# Altium schematic sheet Connectors.SchDoc
size A4; SheetNumber: 2; SheetTotal: 2
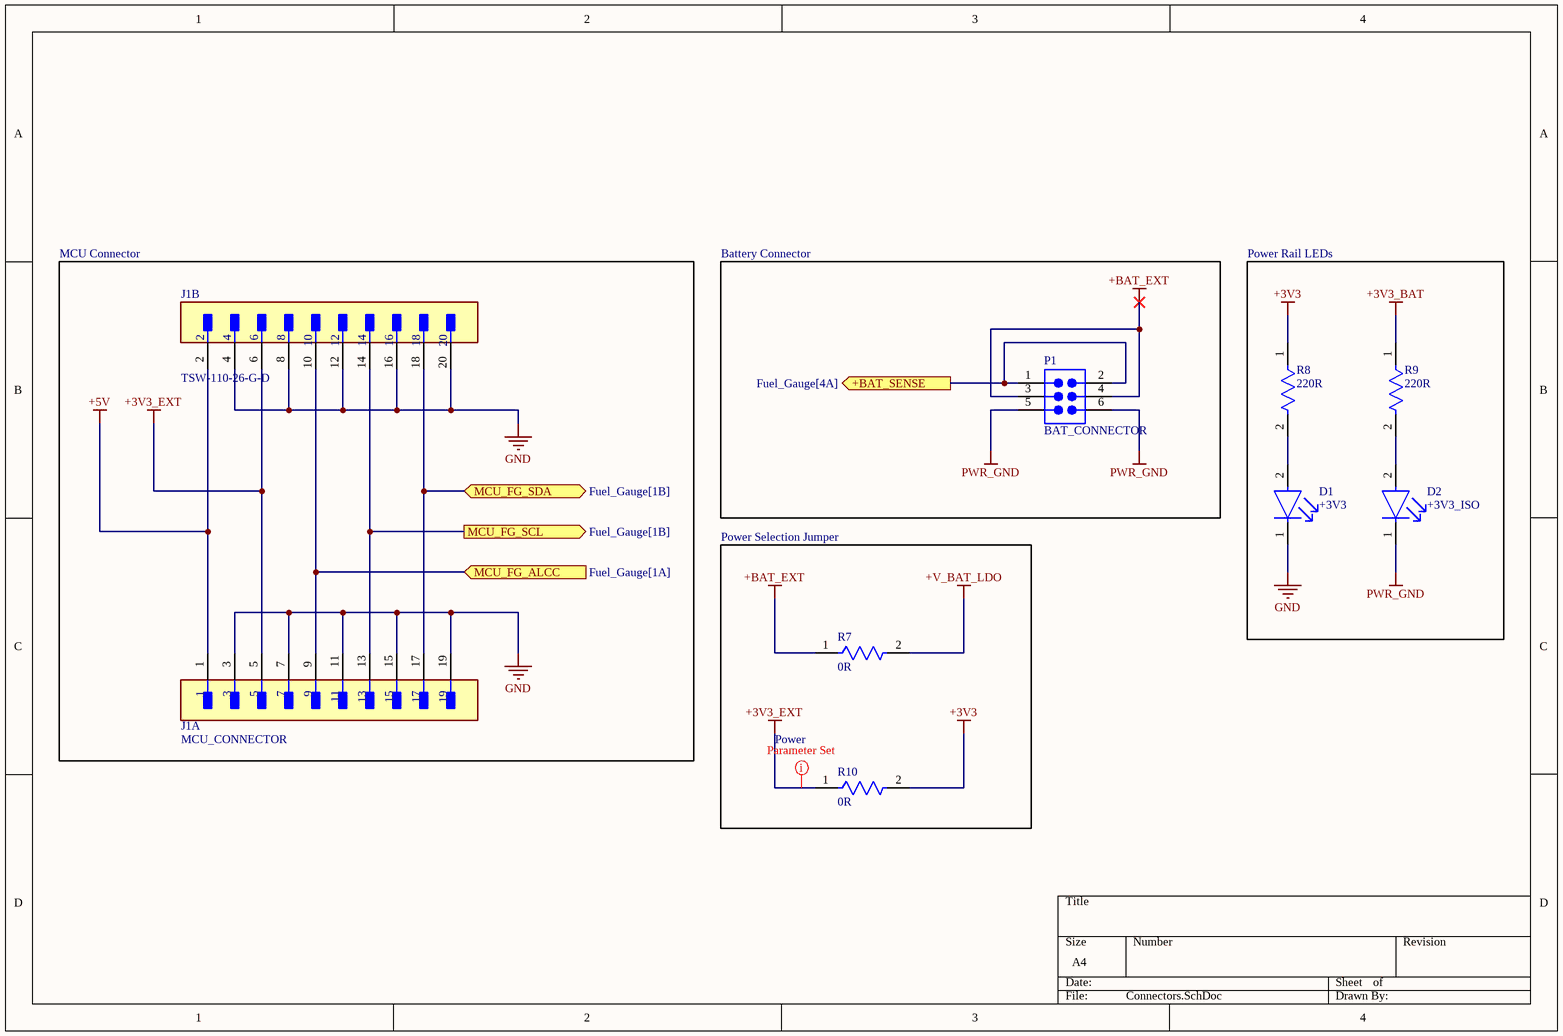
[diagram p0: Connectors.SchDoc]

## Parts
D1  +3V3  [FP-LTST-C170GKT-MFG]
D2  +3V3_ISO  [FP-LTST-C170GKT-MFG]
J1  MCU_CONNECTOR  [FP-TSW-110-26-G-D-MFG]  (parts A,B of 2)
P1  BAT_CONNECTOR  [SMTC-TSW-103-08-X-D]
R7  0R  [FP-AF0805-IPC_B]
R8  220R  [FP-RT0805-MFG]
R9  220R  [FP-RT0805-MFG]
R10  0R  [FP-AF0805-IPC_B]

## Blocks framed on the sheet
MCU Connector: J1
Battery Connector: P1
Power Rail LEDs: D1 D2 R8 R9
Power Selection Jumper: R7 R10

## Ports
+BAT_SENSE (out, see Fuel_Gauge[4A]), MCU_FG_ALCC (in, see Fuel_Gauge[1A]), MCU_FG_SCL (out, see Fuel_Gauge[1B]), MCU_FG_SDA (bidir, see Fuel_Gauge[1B])

## Nets
+3V3: R8.1 R10.2
+3V3_BAT: R9.1
+3V3_EXT: J1.5 J1.6 R10.1
+5V: J1.1 J1.2
+BAT_EXT: P1.3 P1.4 R7.1
+V_BAT_LDO: R7.2
GND: D1.1(C) J1.3 J1.4 J1.7 J1.8 J1.11 J1.12 J1.15 J1.16 J1.19 J1.20
PWR_GND: D2.1(C) P1.5 P1.6
+BAT_SENSE: P1.1 P1.2 ; port +BAT_SENSE
MCU_FG_ALCC: J1.9 J1.10 ; port MCU_FG_ALCC
MCU_FG_SCL: J1.13 J1.14 ; port MCU_FG_SCL
MCU_FG_SDA: J1.17 J1.18 ; port MCU_FG_SDA
NetD1_2: D1.2(A) R8.2
NetD2_2: D2.2(A) R9.2

## Layout directives
net class Power: +3V3_EXT

## Library data of the parts
D1 D2 = CMP-1674-00002-6: LED GREEN CLEAR SMD; Dominant Wavelength: 569nm; Lens Style: Diffused; Forward Voltage: 2.1V; Number of Elements: 1; Wavelength: 565nm; Luminous Intensity: 6mcd; Test Current: 10mA; Power Dissipation: 100mW; Reverse Voltage: 5V; Forward Current: 30mA; Viewing Angle: 130°; Lens Color: Colorless; Min Operating Temperature: -55°C; Number of Pins: 2; Max Operating Temperature: 85°C; Color: Green; Radiation Hardening: No; Illumination Color: Green; Case Code (Metric): 2012; Lens Transparency: Clear; Case/Package: 0805; Width: 1.25mm; Case Code (Imperial): 0805; Package Quantity: 1; Height: 1.1mm; Depth: 1.25mm; Length: 2mm; Power Rating: 100mW; Lead Free: Lead Free; Number of LEDs: 1; Packaging: Tape and Reel; Mount: Surface Mount; Voltage: 5V
J1 = CMP-02766-000032-1: CONN HEADER VERT 20POS 2.54MM; Manufacturer Part Number: TSW-110-26-G-D; Manufacturer: Samtec; Conn Orientation: Vertical; Number Of Contacts: 20; Conn Gender: Male; Footprint Url: http://suddendocs.samtec.com/prints/tsw-xxx-xx-x-x-xx-xxx-footprint.pdf; Automotive: No; RoHS: TRUE; Device Class L1: Connectors; Temperature Range Low: -55°C; ComponentLink2Description: Datasheet; Temperature: -55°C to +125°C; Octopart: https://octopart.com/tsw-110-26-g-d-samtec-274552; Category: Conn; Number Of Rows: 2; Lead Free: Yes; Temperature Range High: +125°C; Package: TSW-110-26-G-D; Device Class L2: Headers and Wire Housings; Contact Material: Gold,Nickel; Digikey Description: CONN HEADER VERT 20POS 2.54MM; Height: 8.71mm; ComponentLink2URL: http://suddendocs.samtec.com/prints/tsw-xxx-xx-xxx-x-xx-xxx-mkt.pdf; Pitch: 2.54mm; Device Class L3: unset
P1 = CMP-1024-00338-1: 0.025" SQ Post Header, Through-hole, Vertical, -55 to 125 degC, 2.54 mm Pitch, 6-Pin, Male, RoHS; Manufacturer: Samtec; PartNumber: TSW-103-08-G-D; Pitch: 2.54 mm; ComponentLink1URL: http://www.samtec.com; ComponentLink2URL: http://www.samtec.com/documents/webfiles/pdf/TSW_TH.PDF; Temperature Range: -55 to 125 degC; RoHS: True; ComponentLink2Description: Datasheet; PackageReference: TSW-103-08-X-D; ComponentLink3Description: Package Specification; PackageDescription: .025[0.64] SQ. Post Terminal Strip Assembly; DatasheetVersion: F-214; Mounting Technology: Through-hole; ComponentLink1Description: Manufacturer URL; Orientation: Vertical; PackageVersion: DM, 8/1988; ComponentLink3URL: http://www.samtec.com/documents/webfiles/cpdf/TSW-XXX-XX-XXX-X-XX-XXX-MKT.pdf
R7 R10 = CMP-03412-047152-1: Anti-Sulfurated Chip Resistor Automotive Grade 0Ω Jumper 0.125W 0805; Max Power Dissipation: 125mW; Length: 0.079inch; Package Quantity: 5000; Packaging: Tape and Reel; Height: 0.024inch; Series: AF; Number of Terminations: 2; Resistance: 0R; Weight: 0.000194oz; Width: 1.25mm; Max Operating Temperature: 155°C; Case Code (Metric): 2012; Resistor Type: Thick Film; RoHS Compliant: Yes; Case Code (Imperial): 0805; Min Operating Temperature: -55°C; Case/Package: 0805; Termination: SMD/SMT; Features: Moisture Resistant
R8 R9 = CMP-03412-035594-1: RES SMD 220 OHM 1% 1/8W 0805; Manufacturer Part Number: RT0805FRE07220RL; Manufacturer: Yageo; Power Rating: 0.125W; Voltage Rating: 150V; Temperature Coefficient: 50 ppm/°C; Resistance: 220Ω; Value: 220Ω; Tolerance: 0.0001; Temperature: -55°C to +155°C; Device Class L2: Resistors; ComponentLink2URL: http://www.yageo.com/documents/recent/PYu-RT_1-to-0.01_RoHS_L_9.pdf; Device Class L3: Chip SMD Resistors; Digikey Description: RES SMD 220 OHM 1% 1/8W 0805; Temperature Range Low: -55°C; Ipc Land Pattern Name: RESC200125X50; Height: 0.6mm; Package: RT0805; Automotive: No; RoHS: TRUE; Octopart: https://octopart.com/rt0805fre07220rl-yageo-39797223; Device Class L1: Passive Components; Temperature Range High: +155°C; Footprint Url: http://www.yageo.com/exep/pages/download/literatures/PYu-R_Mount_10.pdf; Lead Free: Yes; Series: RT; Category: Res; Composition: Thin Film; Mouser Description: Res Thin Film 0805 220 Ohm 1% 1/8W ±50ppm/°C SMD Paper T/R; ComponentLink2Description: Datasheet